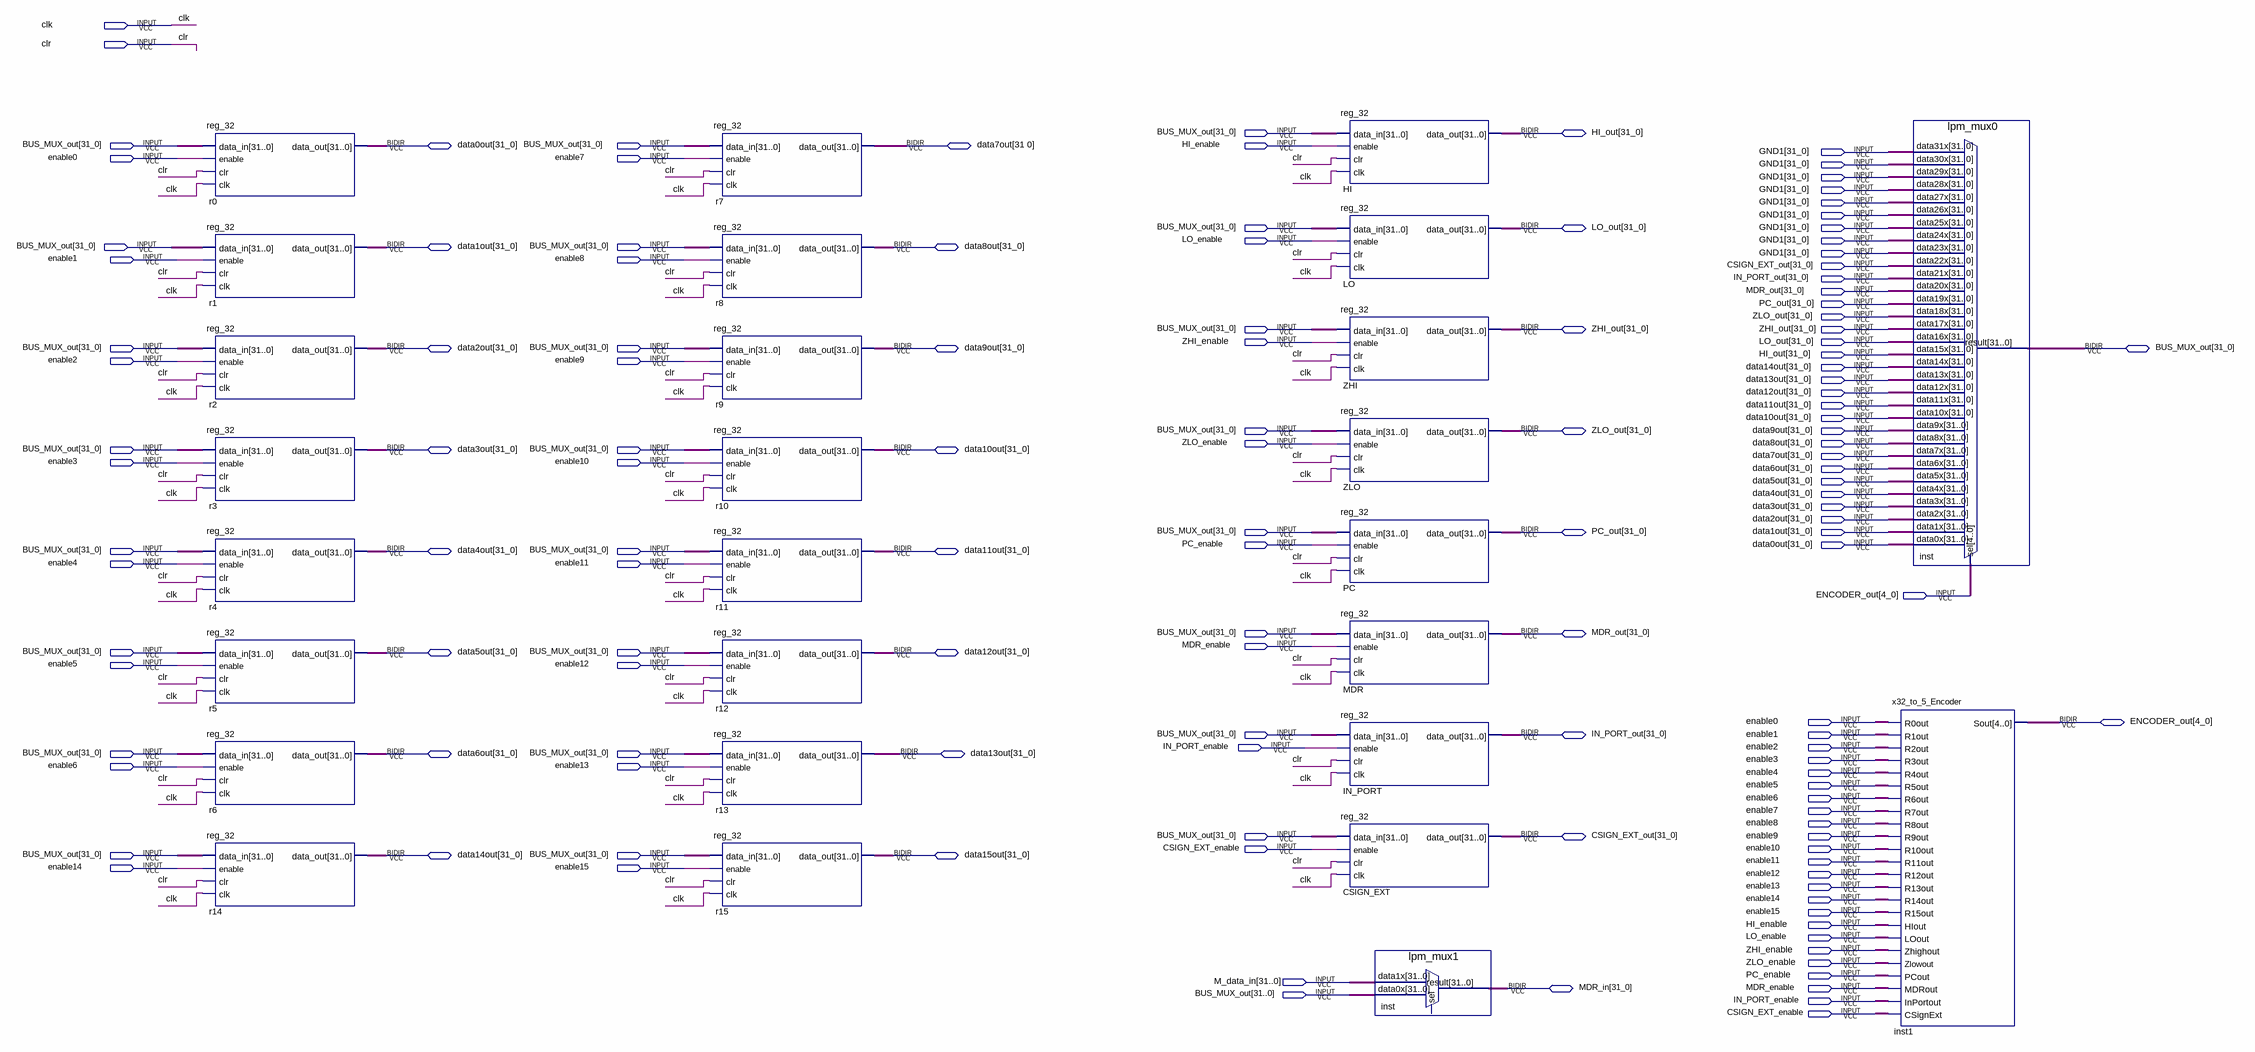
[diagram p0: schematic sheet]
// Quartus schematic reg_block.bdf as structural Verilog: 27 symbols, 136 pins
module reg_block (
  input  clk,
  input  clr,
  inout  \BUS_MUX_out[31_0] ,
  input  HI_enable,
  input  \GND1[31_0] ,
  input  enable0,
  input  enable7,
  input  LO_enable,
  input  enable1,
  input  enable8,
  inout  \CSIGN_EXT_out[31_0] ,
  inout  \IN_PORT_out[31_0] ,
  inout  \MDR_out[31_0] ,
  inout  \PC_out[31_0] ,
  inout  \ZLO_out[31_0] ,
  inout  \ZHI_out[31_0] ,
  input  ZHI_enable,
  inout  \LO_out[31_0] ,
  inout  \HI_out[31_0] ,
  input  enable2,
  input  enable9,
  inout  \data14out[31_0] ,
  inout  \data13out[31_0] ,
  inout  \data12out[31_0] ,
  inout  \data11out[31_0] ,
  inout  \data10out[31_0] ,
  inout  \data9out[31_0] ,
  input  ZLO_enable,
  inout  \data8out[31_0] ,
  input  \data7out[31_0] ,
  input  enable3,
  input  enable10,
  inout  \data6out[31_0] ,
  inout  \data5out[31_0] ,
  inout  \data4out[31_0] ,
  inout  \data3out[31_0] ,
  inout  \data2out[31_0] ,
  inout  \data1out[31_0] ,
  input  PC_enable,
  inout  \data0out[31_0] ,
  input  enable4,
  input  enable11,
  inout  \ENCODER_out[4_0] ,
  input  MDR_enable,
  input  enable5,
  input  enable12,
  input  IN_PORT_enable,
  input  enable6,
  input  enable13,
  input  CSIGN_EXT_enable,
  input  enable14,
  input  enable15,
  input  [31:0] M_data_in,
  input  [31:0] BUS_MUX_out,
  inout  \data7out[31_0] ,
  inout  \data15out[31_0] ,
  inout  \MDR_in[31_0] 
);

  wire [4:0] inst1_sout, undriven_57;
  wire [31:0] CSIGN_EXT_data_out, HI_data_out, IN_PORT_data_out, inst_result, inst_result_2, LO_data_out,
       MDR_data_out, PC_data_out, r0_data_out, r1_data_out, r2_data_out, r3_data_out, r4_data_out,
       r5_data_out, r6_data_out, r7_data_out, r8_data_out, r9_data_out, r10_data_out, r11_data_out,
       r12_data_out, r13_data_out, r14_data_out, r15_data_out, undriven, undriven_2, undriven_3, undriven_4,
       undriven_5, undriven_6, undriven_7, undriven_8, undriven_9, undriven_10, undriven_11, undriven_12,
       undriven_13, undriven_14, undriven_15, undriven_16, undriven_17, undriven_18, undriven_19,
       undriven_20, undriven_21, undriven_22, undriven_23, undriven_24, undriven_25, undriven_26,
       undriven_27, undriven_28, undriven_29, undriven_30, undriven_31, undriven_32, undriven_33,
       undriven_34, undriven_35, undriven_36, undriven_37, undriven_38, undriven_39, undriven_40,
       undriven_41, undriven_42, undriven_43, undriven_44, undriven_45, undriven_46, undriven_47,
       undriven_48, undriven_49, undriven_50, undriven_51, undriven_52, undriven_53, undriven_54,
       undriven_55, undriven_56, ZHI_data_out, ZLO_data_out;

  reg_32 r0 (.data_in(undriven), .enable(enable0), .clr(clr), .clk(clk), .data_out(r0_data_out));
  reg_32 r1 (.data_in(undriven_16), .enable(enable1), .clr(clr), .clk(clk), .data_out(r1_data_out));
  reg_32 r2 (.data_in(undriven_2), .enable(enable2), .clr(clr), .clk(clk), .data_out(r2_data_out));
  reg_32 r3 (.data_in(undriven_3), .enable(enable3), .clr(clr), .clk(clk), .data_out(r3_data_out));
  reg_32 r4 (.data_in(undriven_4), .enable(enable4), .clr(clr), .clk(clk), .data_out(r4_data_out));
  reg_32 r5 (.data_in(undriven_5), .enable(enable5), .clr(clr), .clk(clk), .data_out(r5_data_out));
  reg_32 r6 (.data_in(undriven_6), .enable(enable6), .clr(clr), .clk(clk), .data_out(r6_data_out));
  reg_32 r14 (.data_in(undriven_14), .enable(enable14), .clr(clr), .clk(clk), .data_out(r14_data_out));
  reg_32 r7 (.data_in(undriven_7), .enable(enable7), .clr(clr), .clk(clk), .data_out(r7_data_out));
  reg_32 r8 (.data_in(undriven_8), .enable(enable8), .clr(clr), .clk(clk), .data_out(r8_data_out));
  reg_32 r9 (.data_in(undriven_9), .enable(enable9), .clr(clr), .clk(clk), .data_out(r9_data_out));
  reg_32 r10 (.data_in(undriven_10), .enable(enable10), .clr(clr), .clk(clk), .data_out(r10_data_out));
  reg_32 r11 (.data_in(undriven_11), .enable(enable11), .clr(clr), .clk(clk), .data_out(r11_data_out));
  reg_32 r12 (.data_in(undriven_12), .enable(enable12), .clr(clr), .clk(clk), .data_out(r12_data_out));
  reg_32 r13 (.data_in(undriven_13), .enable(enable13), .clr(clr), .clk(clk), .data_out(r13_data_out));
  reg_32 r15 (.data_in(undriven_15), .enable(enable15), .clr(clr), .clk(clk), .data_out(r15_data_out));
  reg_32 HI (.data_in(undriven_17), .enable(HI_enable), .clr(clr), .clk(clk), .data_out(HI_data_out));
  reg_32 LO (.data_in(undriven_18), .enable(LO_enable), .clr(clr), .clk(clk), .data_out(LO_data_out));
  reg_32 ZHI (.data_in(undriven_19), .enable(ZHI_enable), .clr(clr), .clk(clk), .data_out(ZHI_data_out));
  reg_32 ZLO (.data_in(undriven_20), .enable(ZLO_enable), .clr(clr), .clk(clk), .data_out(ZLO_data_out));
  reg_32 PC (.data_in(undriven_21), .enable(PC_enable), .clr(clr), .clk(clk), .data_out(PC_data_out));
  reg_32 MDR (.data_in(undriven_22), .enable(MDR_enable), .clr(clr), .clk(clk), .data_out(MDR_data_out));
  reg_32 IN_PORT (.data_in(undriven_23), .enable(IN_PORT_enable), .clr(clr), .clk(clk), .data_out(IN_PORT_data_out));
  reg_32 CSIGN_EXT (
    .data_in(undriven_24), .enable(CSIGN_EXT_enable), .clr(clr), .clk(clk), .data_out(CSIGN_EXT_data_out));
  lpm_mux1 inst (.data1x(M_data_in), .data0x(BUS_MUX_out), .result(inst_result_2));  // open: sel
  lpm_mux0 inst_dup2 (
    .data31x(undriven_56), .data30x(undriven_55), .data29x(undriven_54), .data28x(undriven_53),
    .data27x(undriven_52), .data26x(undriven_51), .data25x(undriven_50), .data24x(undriven_49),
    .data23x(undriven_48), .data22x(undriven_47), .data21x(undriven_46), .data20x(undriven_45),
    .data19x(undriven_44), .data18x(undriven_43), .data17x(undriven_42), .data16x(undriven_41),
    .data15x(undriven_40), .data14x(undriven_39), .data13x(undriven_38), .data12x(undriven_37),
    .data11x(undriven_36), .data10x(undriven_35), .data9x(undriven_34), .data8x(undriven_33),
    .data7x(undriven_32), .data6x(undriven_31), .data5x(undriven_30), .data4x(undriven_29),
    .data3x(undriven_28), .data2x(undriven_27), .data1x(undriven_26), .data0x(undriven_25),
    .sel(undriven_57), .result(inst_result));
  x32_to_5_Encoder inst1 (
    .R0out(enable0), .R1out(enable1), .R2out(enable2), .R3out(enable3), .R4out(enable4), .R5out(enable5),
    .R6out(enable6), .R7out(enable7), .R8out(enable8), .R9out(enable9), .R10out(enable10), .R11out(enable11),
    .R12out(enable12), .R13out(enable13), .R14out(enable14), .R15out(enable15), .HIout(HI_enable),
    .LOout(LO_enable), .Zhighout(ZHI_enable), .Zlowout(ZLO_enable), .PCout(PC_enable), .MDRout(MDR_enable),
    .InPortout(IN_PORT_enable), .CSignExt(CSIGN_EXT_enable), .Sout(inst1_sout));
endmodule
